# Altium schematic sheet WUST_DEMO.SchDoc
size A4; PageSetup: Record=PageOptions|CenterHorizontal=True|CenterVertical=True|PrintScale=1.00|XCorrection=1.00|YCorrection=1.00|PrintKind=1|BorderSize=5000000|LeftOffset=0|BottomOffset=0|Orientation=2|PaperLength=1000|PaperWidth=1000|Scale=100|PaperSource=7|PrintQuality=-4|MediaType=1|DitherType=10|PaperKind=A4|PrintScaleMode=0
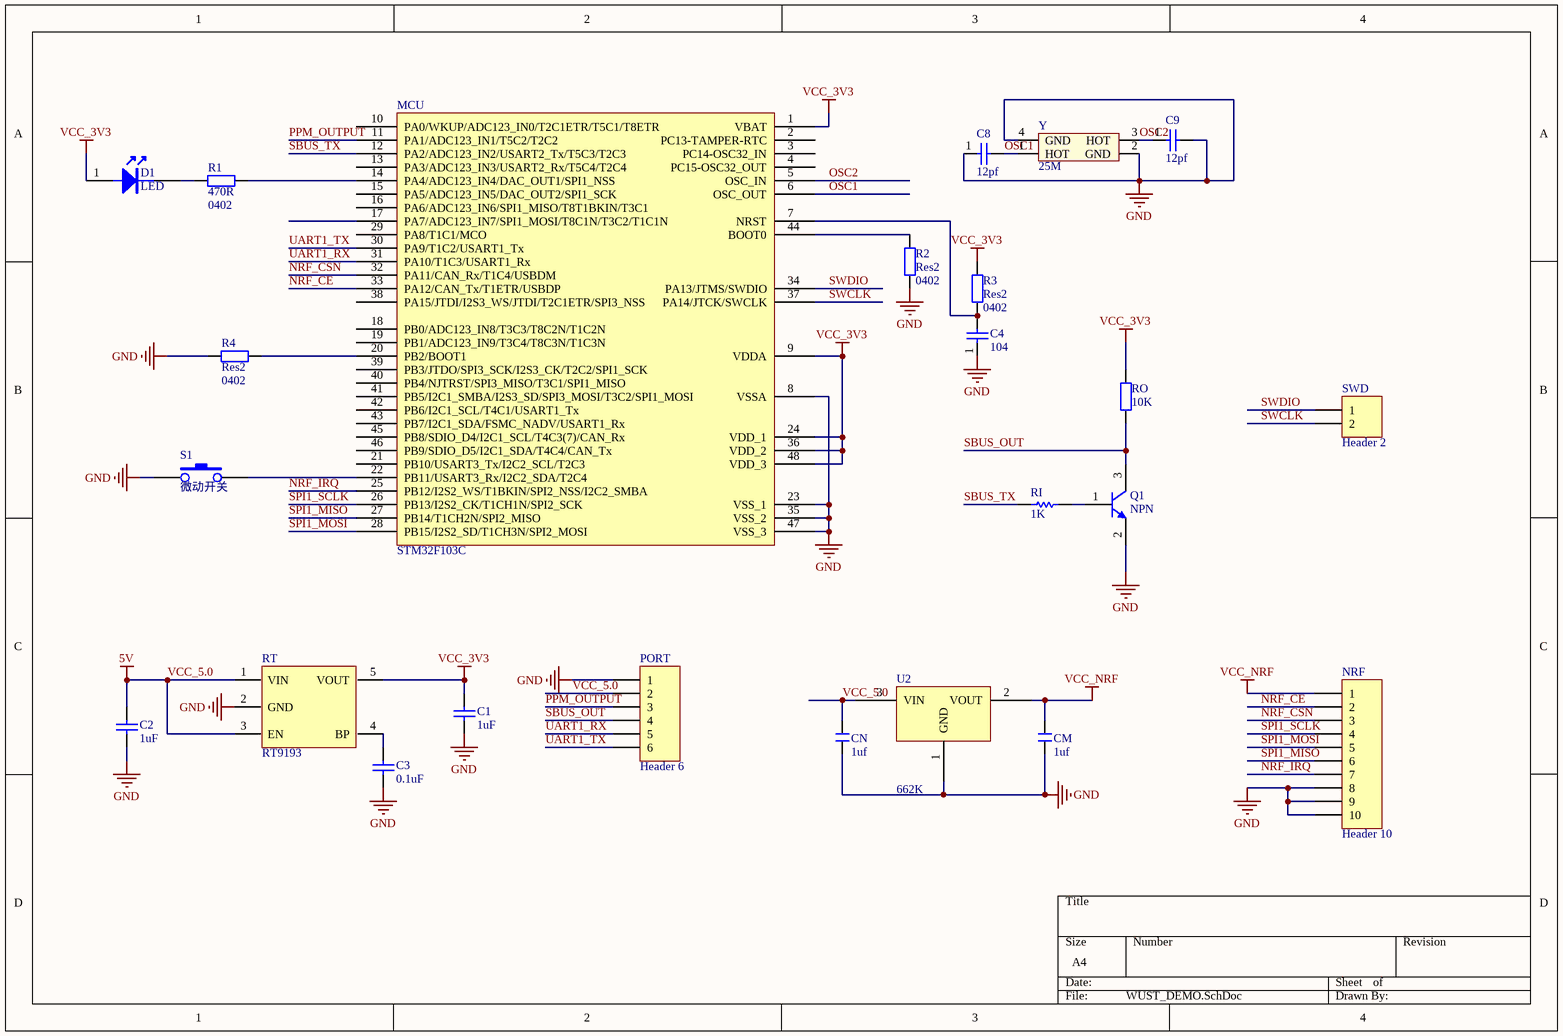
[diagram p0: WUST_DEMO.SchDoc]

## Parts
C1  value 1uF  [0603C]  (hidden comment: Cap)
C2  value 1uF  [0603C]  (hidden comment: Cap)
C3  value 0.1uF  [0402C]  (hidden comment: Cap)
C4  value 104  [0402C]  (hidden comment: Cap)
C8  value 12pf  [0402C]  (hidden comment: Cap)
C9  value 12pf  [0402C]  (hidden comment: Cap)
CM  1uf  [0603C]
CN  1uf  [0603C]
D1  LED  [0603_LED]
MCU  STM32F103C  [LQFP-48_7x7x05P]
NRF  Header 10  [PE01-ML01SP4]
PORT  Header 6  [1.25_6P]
Q1  NPN  [SOT23_N]
R1  470R  value 0402  [0402R]
R2  Res2  value 0402  [0402R]
R3  Res2  value 0402  [0402R]
R4  Res2  value 0402  [0402R]
RI  value 1K  [0402R]  (hidden comment: res1)
RO  value 10K  [0402R]  (hidden comment: Res1)
RT  RT9193  [SOT23_5]
S1  微动开关  [KEY3420P]
SWD  Header 2  [pad]
U2  662K  [SOT23-3N]
Y  25M  [SMD-3225_4P]

## Nets
GND: C1.1 C2.1 C3.1 C4.1 C8.1 C9.2 CM.1 CN.1 MCU.8(VSSA) MCU.23(VSS_1) MCU.35(VSS_2) MCU.47(VSS_3) NRF.8 NRF.9 NRF.10 PORT.1 Q1.2(E) R2.1 R4.2 RT.2(GND) S1.1 U2.1(GND) Y.2(GND) Y.4(GND)
VCC_3V3: C1.2 D1.1 MCU.1(VBAT) MCU.9(VDDA) MCU.24(VDD_1) MCU.36(VDD_2) MCU.48(VDD_3) R3.2 RO.2 RT.5(VOUT)
VCC_5.0: C2.2 CN.2 PORT.2 RT.1(VIN) RT.3(EN) U2.3(VIN)  [also labelled 5V]
VCC_NRF: CM.2 NRF.1 U2.2(VOUT)
NRF_CE: MCU.33(PA12/CAN_Tx/T1ETR/USBDP) NRF.2
NRF_CSN: MCU.32(PA11/CAN_Rx/T1C4/USBDM) NRF.3
NRF_IRQ: MCU.25(PB12/I2S2_WS/T1BKIN/SPI2_NSS/I2C2_SMBA) NRF.7
OSC1: C8.2 MCU.6(OSC_OUT) Y.1(HOT)
OSC2: C9.1 MCU.5(OSC_IN) Y.3(HOT)
PPM_OUTPUT: MCU.11(PA1/ADC123_IN1/T5C2/T2C2) PORT.3
SBUS_OUT: PORT.4 Q1.3(C) RO.1
SBUS_TX: MCU.12(PA2/ADC123_IN2/USART2_Tx/T5C3/T2C3) RI.1
SPI1_MISO: MCU.27(PB14/T1CH2N/SPI2_MISO) NRF.6
SPI1_MOSI: MCU.28(PB15/I2S2_SD/T1CH3N/SPI2_MOSI) NRF.5
SPI1_SCLK: MCU.26(PB13/I2S2_CK/T1CH1N/SPI2_SCK) NRF.4
SWCLK: MCU.37(PA14/JTCK/SWCLK) SWD.2
SWDIO: MCU.34(PA13/JTMS/SWDIO) SWD.1
UART1_RX: MCU.31(PA10/T1C3/USART1_Rx) PORT.5
UART1_TX: MCU.30(PA9/T1C2/USART1_Tx) PORT.6
NetC3_2: C3.2 RT.4(BP)
NetC4_2: C4.2 MCU.7(NRST) R3.1
NetD1_2: D1.2 R1.2
NetMCU_14: MCU.14(PA4/ADC123_IN4/DAC_OUT1/SPI1_NSS) R1.1
NetMCU_20: MCU.20(PB2/BOOT1) R4.1
NetMCU_22: MCU.22(PB11/USART3_Rx/I2C2_SDA/T2C4) S1.2
NetMCU_44: MCU.44(BOOT0) R2.2
NetQ1_1: Q1.1(B) RI.2

Not connected (* = marked no-connect by the designer): MCU 2(PC13-TAMPER-RTC) 3(PC14-OSC32_IN) 4(PC15-OSC32_OUT) 10(PA0/WKUP/ADC123_IN0/T2C1ETR/T5C1/T8ETR) 13(PA3/ADC123_IN3/USART2_Rx/T5C4/T2C4) 15(PA5/ADC123_IN5/DAC_OUT2/SPI1_SCK) 16(PA6/ADC123_IN6/SPI1_MISO/T8T1BKIN/T3C1) 17(PA7/ADC123_IN7/SPI1_MOSI/T8C1N/T3C2/T1C1N) 18(PB0/ADC123_IN8/T3C3/T8C2N/T1C2N) 19(PB1/ADC123_IN9/T3C4/T8C3N/T1C3N) 21(PB10/USART3_Tx/I2C2_SCL/T2C3) 29(PA8/T1C1/MCO) 38(PA15/JTDI/I2S3_WS/JTDI/T2C1ETR/SPI3_NSS) 39(PB3/JTDO/SPI3_SCK/I2S3_CK/T2C2/SPI1_SCK) 40(PB4/NJTRST/SPI3_MISO/T3C1/SPI1_MISO) 41(PB5/I2C1_SMBA/I2S3_SD/SPI3_MOSI/T3C2/SPI1_MOSI) 42(PB6/I2C1_SCL/T4C1/USART1_Tx) 43(PB7/I2C1_SDA/FSMC_NADV/USART1_Rx) 45(PB8/SDIO_D4/I2C1_SCL/T4C3(7)/CAN_Rx) 46(PB9/SDIO_D5/I2C1_SDA/T4C4/CAN_Tx)

## Library data of the parts
C1-C3 = Cap: 无极性电容; Published: 8-Jun-2000; LatestRevisionDate: 17-Jul-2002; LatestRevisionNote: Re-released for DXP Platform.; PackageReference: RAD-0.3; Publisher: Altium Limited
C4 C8 C9 = Cap-0.1Uf
CM CN = C: 无极性贴片电容; 版权归属: 源创客; BOM名称: 无极性贴片电容; 学习资源: www.ooocke.com
D1 = Led0
MCU = STM32F103C: STM32单片机48引脚
NRF = Header 10: Header, 10-Pin; LatestRevisionDate: 17-Jul-2002; LatestRevisionNote: Re-released for DXP Platform.; Publisher: Altium Limited
PORT = Header 6: Header, 6-Pin; LatestRevisionDate: 17-Jul-2002; LatestRevisionNote: Re-released for DXP Platform.; Publisher: Altium Limited
Q1 = NPN: pin to pad: 1>3 3>1
R1-R4 = Res2: Resistor; Published: 8-Jun-2000; LatestRevisionDate: 17-Jul-2002; LatestRevisionNote: Re-released for DXP Platform.; PackageReference: AXIAL-0.4; Publisher: Altium Limited; PackageDescription: Axial Device, Thru-Hole; 2 Leads; 0.4 in Pin Spacing
RO = Res1: 贴片电阻; Published: 8-Jun-2000; LatestRevisionDate: 17-Jul-2002; LatestRevisionNote: Re-released for DXP Platform.; PackageReference: AXIAL-0.4; Publisher: Altium Limited
SWD = Header 2: Header, 2-Pin; LatestRevisionDate: 17-Jul-2002; LatestRevisionNote: Re-released for DXP Platform.; Publisher: Altium Limited
Y = XTAL_3225: 3225贴片无源晶振